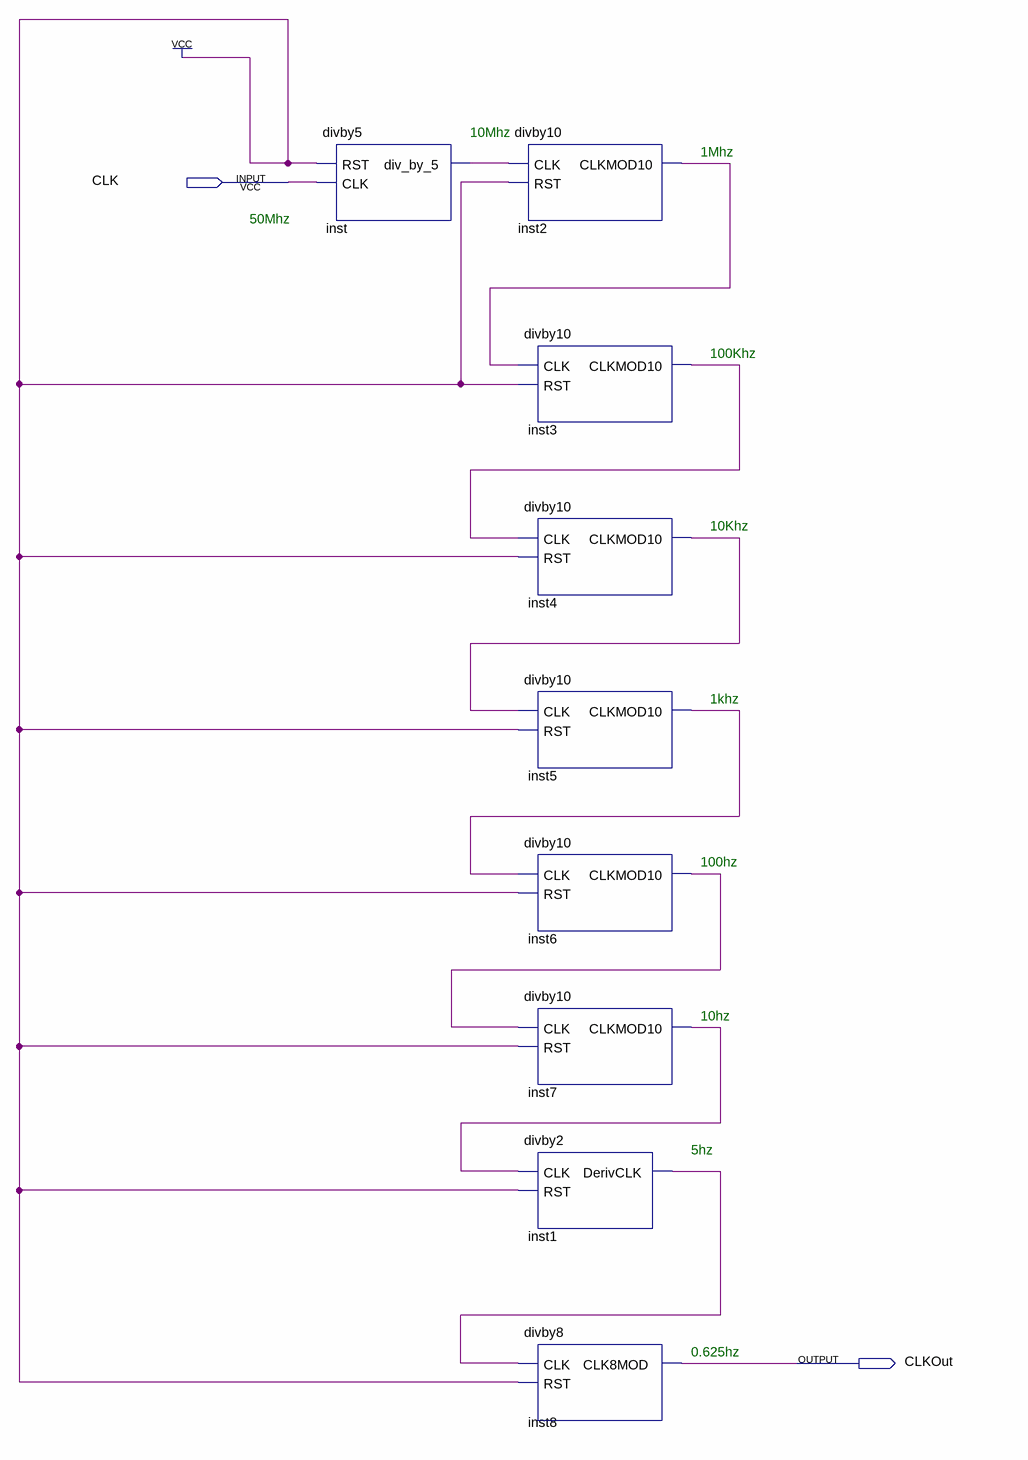
[diagram p0: schematic sheet]
// Quartus schematic ZeroPoint625Hz_clock.bdf as structural Verilog: 9 symbols, 2 pins
module ZeroPoint625Hz_clock (
  input  CLK,
  output CLKOut
);

  wire inst1_derivclk, inst2_clkmod10, inst3_clkmod10, inst4_clkmod10, inst5_clkmod10, inst6_clkmod10,
       inst7_clkmod10, inst_div_by_5;

  divby5 inst (.RST(1'b1), .CLK(CLK), .div_by_5(inst_div_by_5));
  divby10 inst2 (.CLK(inst_div_by_5), .RST(1'b1), .CLKMOD10(inst2_clkmod10));
  divby10 inst3 (.CLK(inst2_clkmod10), .RST(1'b1), .CLKMOD10(inst3_clkmod10));
  divby10 inst4 (.CLK(inst3_clkmod10), .RST(1'b1), .CLKMOD10(inst4_clkmod10));
  divby10 inst5 (.CLK(inst4_clkmod10), .RST(1'b1), .CLKMOD10(inst5_clkmod10));
  divby10 inst6 (.CLK(inst5_clkmod10), .RST(1'b1), .CLKMOD10(inst6_clkmod10));
  divby10 inst7 (.CLK(inst6_clkmod10), .RST(1'b1), .CLKMOD10(inst7_clkmod10));
  divby2 inst1 (.CLK(inst7_clkmod10), .RST(1'b1), .DerivCLK(inst1_derivclk));
  divby8 inst8 (.CLK(inst1_derivclk), .RST(1'b1), .CLK8MOD(CLKOut));

  // Notes on the sheet:
  //   10Mhz
  //   1Mhz
  //   50Mhz
  //   100Khz
  //   10Khz
  //   1khz
  //   100hz
  //   10hz
  //   5hz
  //   0.625hz
endmodule
